# Altium project PCB_Project1.PrjPCB
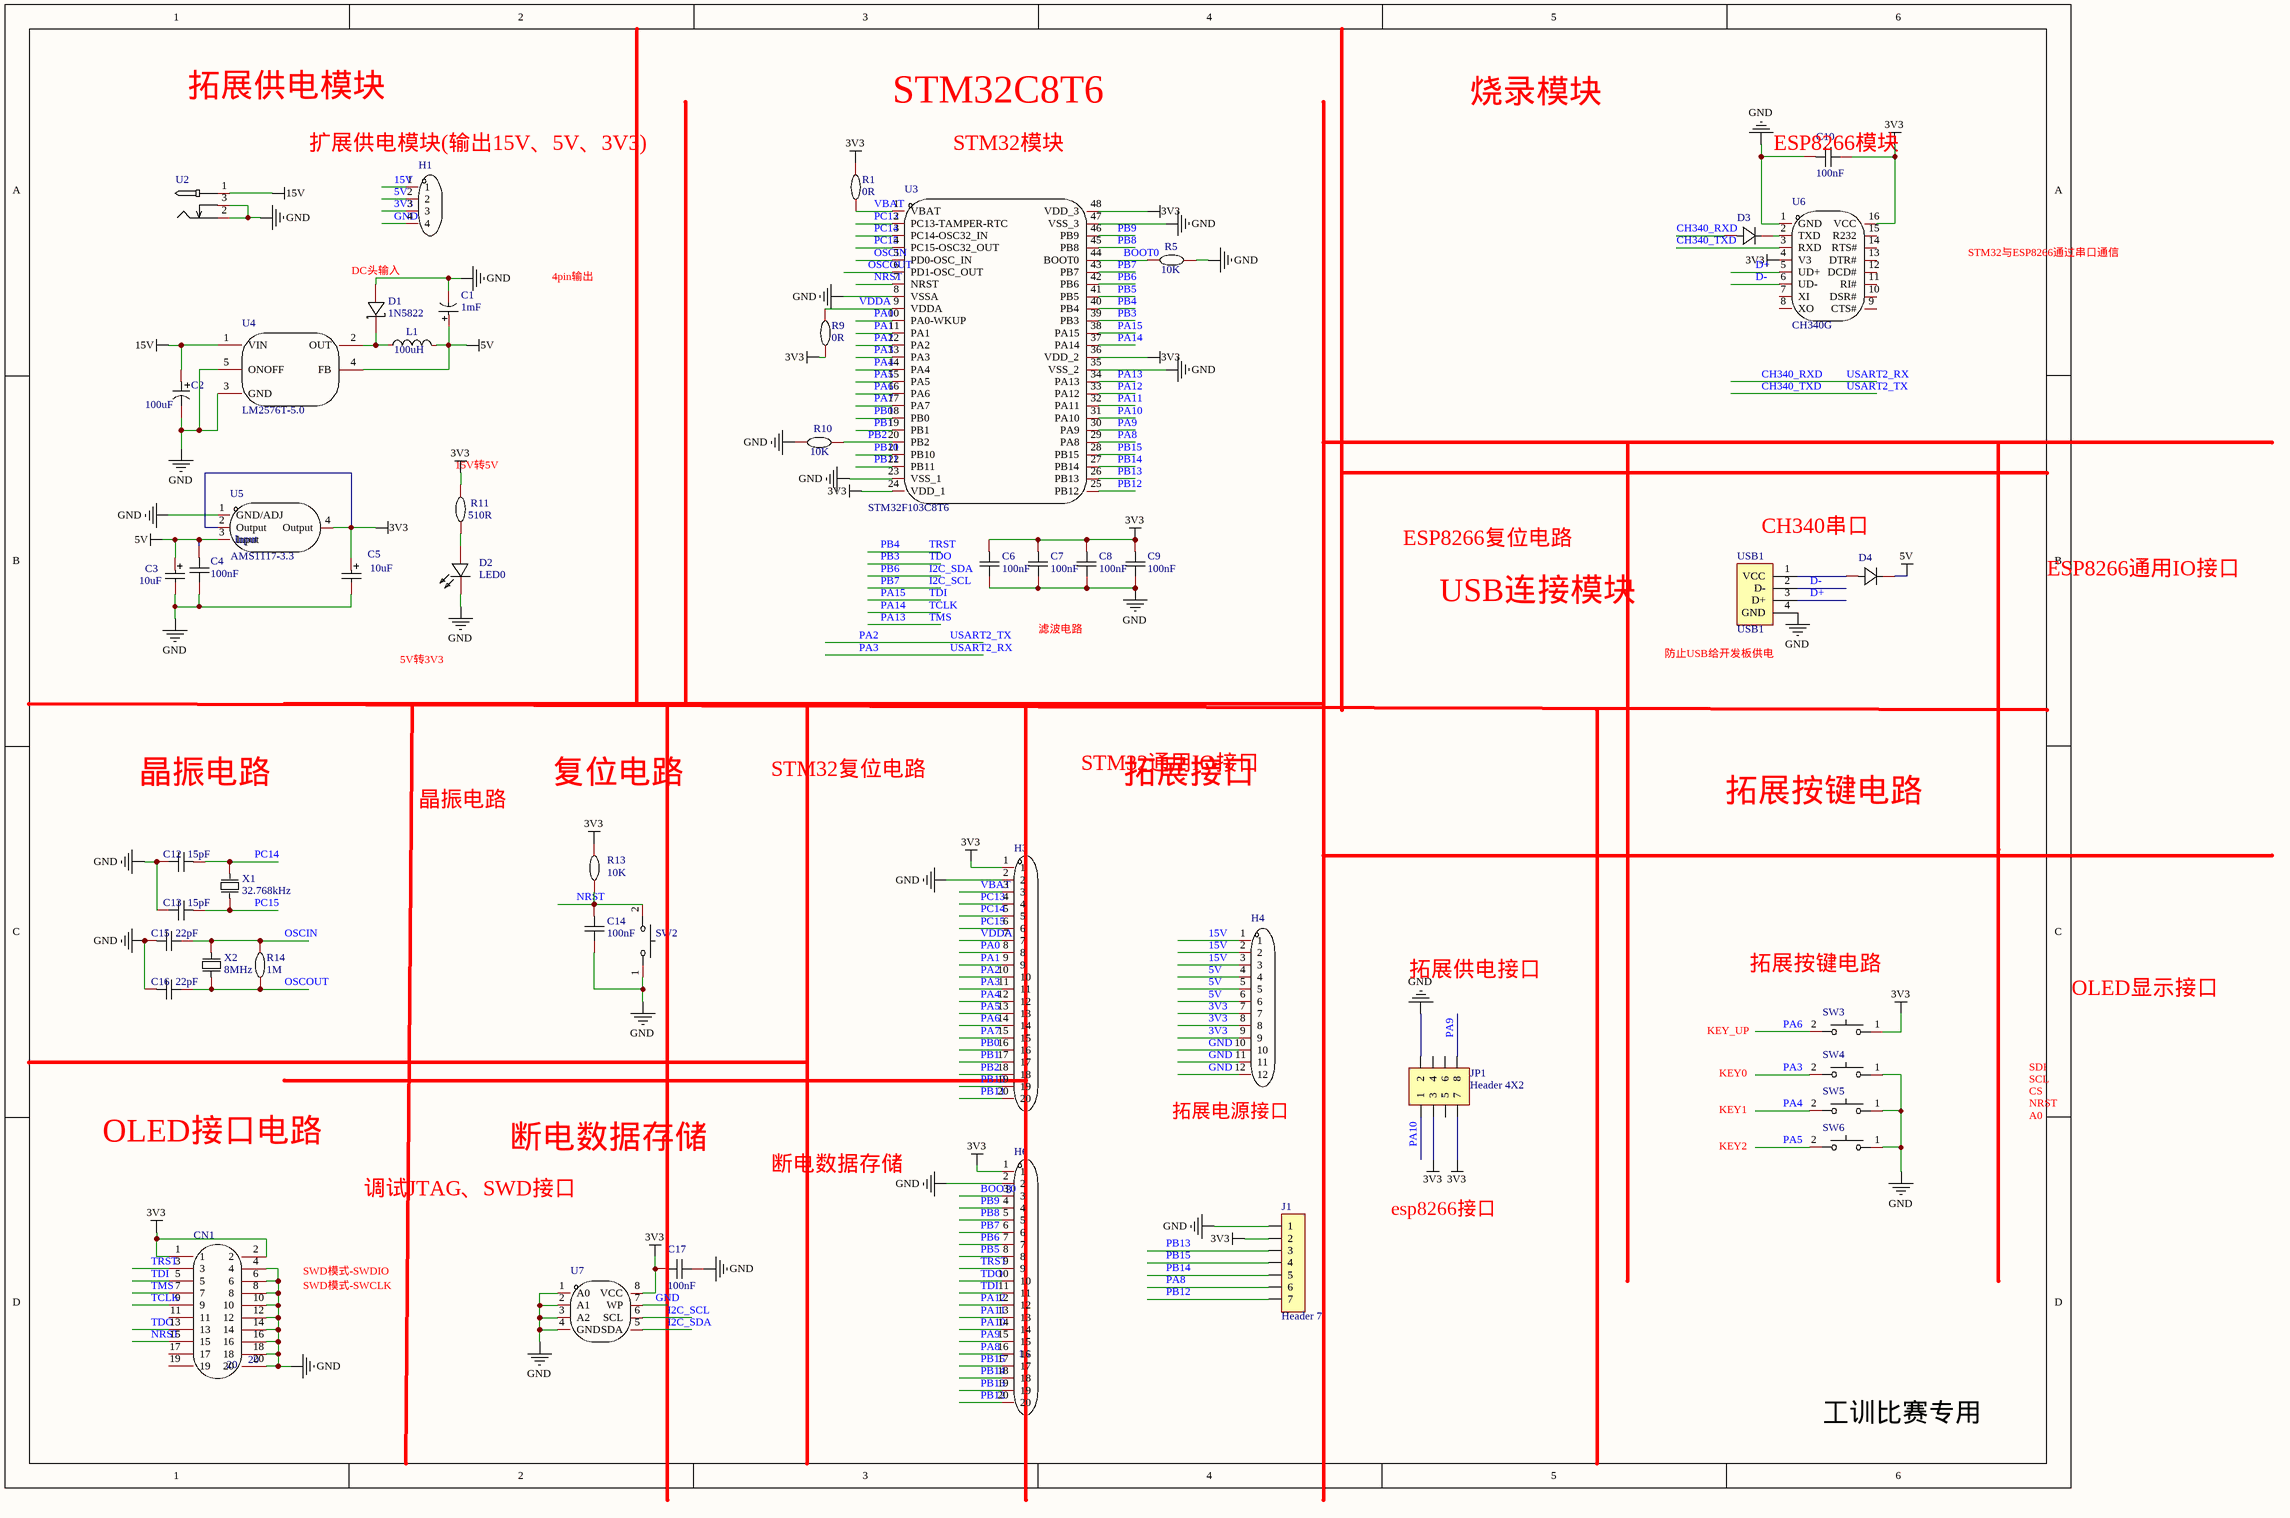
[diagram p0: Sheet1.SchDoc]
1 sheet, 49 parts. Net scope: global (net labels, ports and power ports of the same name join across sheets).
Board file: PCB1.PcbDoc

## Sheet Sheet1.SchDoc
size 431 x 309 mm

### Parts
C1  value 1mF  [CM D8(6.3*7.7)]  (hidden comment: NXA25VB1000M 10*20 LO)
C2  value 100uF  [CM F(8*10.2)]  (hidden comment: XT100UF50V90RV0067)
C3  value 10uF  [CASE-A_3216]  (hidden comment: CA45-A-10V-10uF-K)
C4  value 100nF  [0603_C]  (hidden comment: CAP_0603)
C5  value 10uF  [CASE-A_3216]  (hidden comment: CA45-A-10V-10uF-K)
C6  value 100nF  [0603_C]  (hidden comment: CAP_0603)
C7  value 100nF  [0603_C]  (hidden comment: CAP_0603)
C8  value 100nF  [0603_C]  (hidden comment: CAP_0603)
C9  value 100nF  [0603_C]  (hidden comment: CAP_0603)
C10  value 100nF  [0603_C]  (hidden comment: CAP_0603)
C12  value 15pF  [0603_C]  (hidden comment: CAP_0603)
C13  value 15pF  [0603_C]  (hidden comment: CAP_0603)
C14  value 100nF  [0603_C]  (hidden comment: CAP_0603)
C15  value 22pF  [0603_C]  (hidden comment: CAP_0603)
C16  value 22pF  [0603_C]  (hidden comment: CAP_0603)
C17  value 100nF  [0603_C]  (hidden comment: CAP_0603)
CN1  NAME: 20  [DC-2.54-L-Z-20P]  (hidden comment: HX30002-20A)
D1  1N5822  [SMA(DO-214AC)]
D2  Name: LED0  [LED 0603R]  (hidden comment: 25-21/GHC-YSU/2A)
D3  1N4007  [SOD-323]  (value not drawn)
D4  1N4007  [SOD-323]  (value not drawn)
H1  HDR-M_2.54_1x4P  [HDR2.54-LI-4P]  (value not drawn)
H3  HDR-M_2.54_1x20P  [HDR2.54-LI-20P]  (value not drawn)
H4  HDR-M_2.54_1x12P  [HDR2.54-LI-12P]  (value not drawn)
H6  NAME: 16  NUMBER: 3  [HDR2.54-LI-20P]  (hidden comment: HDR-M_2.54_1x20P)
J1  Header 7  [HDR2.54-LI-7P]
JP1  Header 4X2  [HDR2.54-LI-2x4P]
L1  value 100uH  [CDRH127]  (hidden comment: CY75-100UH)
R1  value 0R  [0603_R]  (hidden comment: RK73Z2BTTD)
R5  value 10K  [0603_R]  (hidden comment: Res_0603)
R9  value 0R  [0603_R]  (hidden comment: Res_0603)
R10  value 10K  [0603_R]  (hidden comment: Res_0603)
R11  value 510R  [0603_R]  (hidden comment: Res_0603)
R13  value 10K  [0603_R]  (hidden comment: Res_0603)
R14  value 1M  [0603_R]  (hidden comment: Res_0603)
SW2  SW-74-3  [TSW SMD-3*6*2.5]  (value not drawn)
SW3  SW-74-3  [TSW SMD-3*6*2.5]  (value not drawn)
SW4  SW-74-3  [TSW SMD-3*6*2.5]  (value not drawn)
SW5  SW-74-3  [TSW SMD-3*6*2.5]  (value not drawn)
SW6  SW-74-3  [TSW SMD-3*6*2.5]  (value not drawn)
U2  DC-210_DC母座,板上插件3P,2mm,黑壳  [DC-005]  (value not drawn)
U3  STM32F103C8T6  [LQFP48 7X7_N]
U4  Name: LM2576T-5.0  [TO-263-5]  (hidden comment: LM2576T-5.0/NOPB)
U5  Name: AMS1117-3.3  NAME: Input  [SOT-223]  (hidden comment: AMS1117-3.3_C369933)
U6  CH340G  [SOP-16_150mil]
U7  AT24C04M/TR  [SOP-8_150mil]  (value not drawn)
USB1  USB1  [USB-A/S_A]
X1  value 32.768kHz  [OSC 3215-2P]  (hidden comment: ABS06-32.768KHZ-T)
X2  value 8MHz  [HC-49SMD]  (hidden comment: X49SS2-8.000-F20JGDT)

### Nets
3V3: C5.1 C6.2 C7.2 C8.2 C9.2 C10.1 C17.2 CN1.1 CN1.2 H1.3 H3.1 H4.7 H4.8 H4.9 H6.1 J1.2 JP1.3 JP1.7 R1.2 R9.1 R11.2 R13.2 SW3.1 U3.24(VDD_1) U3.36(VDD_2) U3.48(VDD_3) U5.2(Output) U5.4(Output) U6.4(V3) U6.16(VCC) U7.8(VCC)
5V: C1.1 C3.1 C4.2 D4.2(K) H1.2 H4.4 H4.5 H4.6 L1.2 U4.4(FB) U5.3(Input)
15V: C2.1 H1.1 H4.1 H4.2 H4.3 U2.1 U4.1(VIN)
GND: C1.2 C2.2 C3.2 C4.1 C5.2 C6.1 C7.1 C8.1 C9.1 C10.2 C12.1 C13.1 C14.1 C15.2 C16.2 C17.1 CN1.4 CN1.6 CN1.8 CN1.10 CN1.12 CN1.14 CN1.16 CN1.18 CN1.20 D1.2(A) D2.2(K) H1.4 H3.2 H4.10 H4.11 H4.12 H6.2 J1.1 JP1.2 R5.2 R10.1 SW2.1 SW4.1 SW5.1 SW6.1 U2.2 U2.3 U3.8(VSSA) U3.23(VSS_1) U3.35(VSS_2) U3.47(VSS_3) U4.3(GND) U4.5(ONOFF) U5.1(GND/ADJ) U6.1(GND) U7.1(A0) U7.2(A1) U7.3(A2) U7.4(GND) U7.7(WP) USB1.4(GND)
BOOT0: H6.3 R5.1 U3.44(BOOT0)
CH340_RXD: D3.1(A) H3.11 SW4.2 U3.13(PA3)  [also labelled PA3, USART2_RX]
CH340_TXD: H3.10 U3.12(PA2) U6.3(RXD)  [also labelled PA2, USART2_TX]
D+: U6.5(UD+) USB1.3(D+)
D-: U6.6(UD-) USB1.2(D-)
I2C_SCL: H6.6 U3.43(PB7) U7.6(SCL)  [also labelled PB7]
I2C_SDA: H6.7 U3.42(PB6) U7.5(SDA)  [also labelled PB6]
NRST: C14.2 CN1.15 R13.1 SW2.2 U3.7(NRST)
OSCIN: C15.1 R14.2 U3.5(PD0-OSC_IN) X2.2(OSC2)
OSCOUT: C16.1 R14.1 U3.6(PD1-OSC_OUT) X2.1(OSC1)
PA0: H3.8 U3.10(PA0-WKUP)
PA1: H3.9 U3.11(PA1)
PA4: H3.12 SW5.2 U3.14(PA4)
PA5: H3.13 SW6.2 U3.15(PA5)
PA6: H3.14 SW3.2 U3.16(PA6)
PA7: H3.15 U3.17(PA7)
PA8: H6.16 J1.6 U3.29(PA8)
PA9: H6.15 JP1.8 U3.30(PA9)
PA10: H6.14 JP1.1 U3.31(PA10)
PA11: H6.13 U3.32(PA11)
PA12: H6.12 U3.33(PA12)
PA13: CN1.7 U3.34(PA13)  [also labelled TMS]
PA14: CN1.9 U3.37(PA14)  [also labelled TCLK]
PA15: CN1.5 H6.11 U3.38(PA15)  [also labelled TDI]
PB0: H3.16 U3.18(PB0)
PB1: H3.17 U3.19(PB1)
PB2: H3.18 R10.2 U3.20(PB2)
PB3: CN1.13 H6.10 U3.39(PB3)  [also labelled TDO]
PB4: CN1.3 H6.9 U3.40(PB4)  [also labelled TRST]
PB5: H6.8 U3.41(PB5)
PB8: H6.5 U3.45(PB8)
PB9: H6.4 U3.46(PB9)
PB10: H3.19 U3.21(PB10)
PB11: H3.20 U3.22(PB11)
PB12: H6.20 J1.7 U3.25(PB12)
PB13: H6.19 J1.3 U3.26(PB13)
PB14: H6.18 J1.5 U3.27(PB14)
PB15: H6.17 J1.4 U3.28(PB15)
PC13: H3.4 U3.2(PC13-TAMPER-RTC)
PC14: C12.2 H3.5 U3.3(PC14-OSC32_IN) X1.2(OSC2)
PC15: C13.2 H3.6 U3.4(PC15-OSC32_OUT) X1.1(OSC1)
VBAT: H3.3 R1.1 U3.1(VBAT)
VDDA: H3.7 R9.2 U3.9(VDDA)
NetD1_1: D1.1(C) L1.1 U4.2(OUT)
NetD2_1: D2.1(A) R11.1
NetD3_2: D3.2(K) U6.2(TXD)
NetD4_1: D4.1(A) USB1.1(VCC)

Not connected (* = marked no-connect by the designer): CN1 11 17 19; JP1 4 5 6; U6 7(XI) 8(XO) 9(CTS#) 10(DSR#) 11(RI#) 12(DCD#) 13(DTR#) 14(RTS#) 15(R232)

### Notes on the sheet
- 拓展供电模块
- STM32C8T6
- 烧录模块
- USB连接模块
- 晶振电路
- 复位电路
- 拓展接口
- 拓展按键电路
- (near JP1) 拓展电源接口
- OLED接口电路
- 断电数据存储
- esp8266接口
- 工训比赛专用
- (in symbol SW-74-3) 扩展供电模块(输出15V、5V、3V3); STM32模块; ESP8266模块; STM32与ESP8266通过串口通信; DC头输入; 4pin输出; 15V转5V; CH340串口; ESP8266复位电路; ESP8266通用IO接口; 滤波电路; 防止USB给开发板供电; 5V转3V3; STM32通用IO接口; STM32复位电路; 晶振电路; 拓展按键电路; 拓展供电接口; OLED显示接口; KEY_UP; SDI; KEY0; SCL; CS; NRST; KEY1; A0; KEY2; 断电数据存储; 调试JTAG、SWD接口; SWD模式-SWDIO; SWD模式-SWCLK

### Library data of the parts
C1 = NXA25VB1000M 10*20 LO: 容值:1mF;精度:±20%;额定电压:25V;电容体直径:10mm;电容体长度:20mm;脚间距:5mm;工作寿命:7000hrs@105;; Manufacturer: SAMYOUNG(韩国三莹); Symbol: NXA25V1000UF10*20; Add into BOM: yes; Tolerance: ±20%; Rated Voltage: 25V; φD: 10mm; L: 20mm; Name: 1mF; Device: NXA25VB1000M 10*20 LO; LCSC Part Name: 1mF ±20% 25V; Supplier Part: C150381; Manufacturer Part: NXA25VB1000M 10*20 LO; Supplier Footprint: 径向引线,10x20mm; JLCPCB Part Class: 扩展库; Datasheet: https://atta.szlcsc.com/upload/public/pdf/source/20180207/C150381_15179948733761359072.pdf; Supplier: LCSC; Convert to PCB: yes; Lead Spacing: 5mm; Lifetime @ Temp: 7000hrs@105
C2 = XT100UF50V90RV0067: 容值:100uF;额定电压:50V;电容体直径:-;电容体长度:-;纹波电流:-;等效串联电阻:-;工作寿命:-;; Manufacturer: KNSCHA(科尼盛); Add into BOM: yes; Rated Voltage: 50V; Name: 100uF; Symbol: XT100UF50V90RV0067; Device: XT100UF50V90RV0067; LCSC Part Name: 100uF 50V; Supplier Part: C2992599; Manufacturer Part: XT100UF50V90RV0067; Supplier Footprint: SMD,8x10.5mm; JLCPCB Part Class: 扩展库; Datasheet: https://atta.szlcsc.com/upload/public/pdf/source/20220628/DB8CB200A5425945B2B1ADF515822AD1.pdf; Supplier: LCSC; Convert to PCB: yes; φD: -; L: -; Ripple Current: -; Equivalent Series Resistance(ESR): -; Lifetime @ Temp: -
C3 C5 = CA45-A-10V-10uF-K: 额定电压:10V;等效串联电阻:8Ω 100kHz;工作温度:-55~+125;容值:10uF;精度:±10%;; Manufacturer: CEC(振华新云); Add into BOM: yes; Rated Voltage: 10V; Tolerance: ±10%; Name: 10uF; Symbol: CA45-A-10V-10UF-K; Device: CA45-A-10V-10uF-K; LCSC Part Name: 10uF(106) ±10% 10V; Supplier Part: C128253; Manufacturer Part: CA45-A-10V-10uF-K; Supplier Footprint: CASE-A_3216; JLCPCB Part Class: 扩展库; Datasheet: https://atta.szlcsc.com/upload/public/pdf/source/20170914/C128253_1505359751786967904.pdf; Supplier: LCSC; Convert to PCB: yes; Equivalent Series Resistance(ESR): 8Ω 100kHz; Operating Temperature: -55~+125
C4 C6-C10 C12-C17 = CAP_0603: Symbol: C1210X7R475K630NT; Convert to PCB: yes; Device: CAP_0603; Add into BOM: yes; Supplier Footprint: 0603
  C4 C6-C10 C14 C17: Name: 100nF
  C12 C13: Name: 15pF
  C15 C16: Name: 22pF
CN1 = HX30002-20A: 参考系列:-;间距:3mm;插针结构:2x10P;排数:2;每排PIN数:10;行距:3mm;安装方式:-;触头材质:黄铜;; Manufacturer: HX(红星); Symbol: 30002-20A-T1P; Add into BOM: yes; Pitch: 3mm; Pins Structure: 2x10P; Number of PINs Per Row: 10; Name: HX30002-20A; Device: HX30002-20A; LCSC Part Name: 小5569-20A; Supplier Part: C185097; Manufacturer Part: HX30002-20A; Supplier Footprint: 插件,P=3mm; JLCPCB Part Class: 扩展库; Datasheet: https://atta.szlcsc.com/upload/public/pdf/source/20180316/2650DEF6C4F462ECBA0CD08C5E43C847.pdf; Supplier: LCSC; Convert to PCB: yes; Reference Series: -; Number of Rows: 2; Row Spacing: 3mm; Mounting Style: -; Contact Material: 黄铜; NO_CONNECT: yes; NUMBER: 20
D1 = 1N5822: 直流反向耐压(Vr):40V;平均整流电流(Io):3A;正向压降(Vf):525mV@3A;; Manufacturer: 星海; Symbol: 1N5822_C84619; Add into BOM: yes; Reverse Voltage (Vr): 40V; Average Rectified Current (Io): 3A; Name: 1N5822; Device: 1N5822; LCSC Part Name: 40V 3A 525mV@3A; Supplier Part: C84619; Manufacturer Part: 1N5822; Supplier Footprint: DO-201AD; JLCPCB Part Class: 扩展库; Datasheet: https://atta.szlcsc.com/upload/public/pdf/source/20161024/1477288663229.pdf; Supplier: LCSC; Convert to PCB: yes; Forward Voltage (Vf@If): 525mV@3A
D2 = 25-21/GHC-YSU/2A: Manufacturer: EVERLIGHT(亿光); Add into BOM: yes; Symbol: 25-21/GHC-YSU/2A; Device: 25-21/GHC-YSU/2A; LCSC Part Name: LED; Supplier Part: C4749157; Manufacturer Part: 25-21/GHC-YSU/2A; Supplier Footprint: SMD-2,1.6x3.2mm; JLCPCB Part Class: 扩展库; Datasheet: https://atta.szlcsc.com/upload/public/pdf/source/20220713/F252FF7039D6458B569E79FE2BD3F03F.pdf; Supplier: LCSC; Convert to PCB: yes
D3 D4 = 1N4007: 二极管配置:-;直流反向耐压(Vr):1kV;平均整流电流(Io):1A;正向压降(Vf):1.1V@1A;反向电流(Ir):5A@1kV;; Symbol: D_1N4007; Add into BOM: yes; Device: 1N4007; Supplier Footprint: DO-41; Convert to PCB: yes; Supplier Part: C106903; JLCPCB Part Class: Extended Part
H1 = HDR-M_2.54_1x4P: Symbol: PZ254V-11-04P; Convert to PCB: yes; Device: HDR-M_2.54_1x4P; Add into BOM: yes; Supplier Part: C492403; Supplier Footprint: 插件
H3 H6 = HDR-M_2.54_1x20P: 间距:2.54mm;总PIN位数:20;排数:1;插针结构:-;行距:-;安装类型:直插;圆针/方针:-;额定电流:-;额定电压:-;配合针长度:-;塑高:-;触头材质:黄铜;触头镀层:-;颜色:黑色;; Symbol: HDR_2.54-1x20P; Convert to PCB: yes; Device: HDR-M_2.54_1x20P; Add into BOM: yes; Supplier Part: C50981; Supplier Footprint: 插件
H4 = HDR-M_2.54_1x12P: 间距:2.54mm;总PIN位数:12;排数:1;插针结构:1x12P;行距:-;安装类型:直插;圆针/方针:方针;额定电流:3A;额定电压:250V;配合针长度:6mm;塑高:2.5mm;端接针长度:3mm;触头材质:-;工作温度范围:-40~+105;颜色:黑色;; Symbol: HDR_2.54-1x12P; Convert to PCB: yes; Device: HDR-M_2.54_1x12P; Add into BOM: yes; Supplier Part: C2840012; Supplier Footprint: 插件
J1 = Header 7: J  Header, 7-Pin; LatestRevisionDate: 17-Jul-2002; LatestRevisionNote: Re-released for DXP Platform.; Publisher: Altium Limited
JP1 = Header 4X2: J  Header, 4-Pin, Dual row; LatestRevisionDate: 17-Jul-2002; LatestRevisionNote: Re-released for DXP Platform.; Publisher: Altium Limited
L1 = CY75-100UH: 电感值:100uH;精度:±10%;额定电流:730mA;饱和电流(Isat):-;直流电阻(DCR):325mΩ;; Manufacturer: SHOU HAN(首韩); Add into BOM: yes; Tolerance: ±10%; Rated Current: 730mA; DC Resistance (DCR): 325mΩ; Name: 100uH; Symbol: CY75-100UH; Device: CY75-100UH; LCSC Part Name: 100uH ±10% 730mA 325mΩ; Supplier Part: C2929443; Manufacturer Part: CY75-100UH; Supplier Footprint: SMD,7.8x7x5mm; JLCPCB Part Class: 扩展库; Datasheet: https://atta.szlcsc.com/upload/public/pdf/source/20211213/9462A2F321BE8943DF3982CE0F9F6E2B.pdf; Supplier: LCSC; Convert to PCB: yes; Saturation Current (Isat): -; Q @ Freq: -; Frequency - Self Resonant: -; Ratings: -
R1 = RK73Z2BTTD: 阻值:0Ω;精度:-;功率:-;工作温度范围:-55~+155;; Manufacturer: KOA; Add into BOM: yes; Name: 0R; Symbol: RK73Z2BTTD; Device: RK73Z2BTTD; LCSC Part Name: 0Ω 0; Supplier Part: C131706; Manufacturer Part: RK73Z2BTTD; Supplier Footprint: 1206; JLCPCB Part Class: 扩展库; Datasheet: https://atta.szlcsc.com/upload/public/pdf/source/20170918/C131706_1505727048923976489.pdf; Supplier: LCSC; Convert to PCB: yes; Tolerance: -; Power(Watts): -; Operating Temperature Range: -55~+155
R5 R9-R11 R13 R14 = Res_0603: Symbol: 电阻; Convert to PCB: yes; Device: Res_0603; Add into BOM: yes; Supplier Footprint: 0603
  R5 R10 R13: Name: 10K
  R9: Name: 0R
  R11: Name: 510R
  R14: Name: 1M
SW2-SW6 = SW-74-3: 类型:检测开关;额定电流(DC):1mA;额定电压(DC):5V;额定电流(AC):1mA;额定电压(AC):100V;机械寿命:20000;按钮形状:圆形柱塞;引脚样式:PC引脚;开关长度:7mm;开关宽度:4.4mm;开关高度:7.2mm;; Manufacturer: Shinmei(日本神明); Add into BOM: yes; Contact Current (DC): 1mA; Voltage Rating (DC): 5V; Voltage Rating (AC): 100V; Mechanical Life: 20000; Actuator Style: 圆形柱塞; Pin Style: PC引脚; Switch Length: 7mm; Switch Width: 4.4mm; Switch Height: 7.2mm; Name: SW-74-3; Symbol: SW-74-3; Device: SW-74-3; LCSC Part Name: SW-74-3; Supplier Part: C388893; Manufacturer Part: SW-74-3; Supplier Footprint: 插件; JLCPCB Part Class: 扩展库; Datasheet: https://atta.szlcsc.com/upload/public/pdf/source/20190506/C388893_3452A3DB9C6C6AE4480AE332CD6BDAAB.pdf; Supplier: LCSC; Convert to PCB: yes; Type: 检测开关; Contact Current (AC): 1mA
U2 = DC-210_DC母座,板上插件3P,2mm,黑壳: Add into BOM: yes; Name: DC-210_DC母座,板上插件3P,2mm,黑壳; Symbol: DC-210_DC母座,板上插件3P,2MM,黑壳; Device: DC-210_DC母座,板上插件3P,2mm,黑壳; LCSC Part Name: DC-210_DC母座,板上插件3P,2mm,黑壳; Supplier Part: C9900012165; Manufacturer Part: DC-210_DC母座,板上插件3P,2mm,黑壳; Supplier Footprint: DC-210_2.0mm; JLCPCB Part Class: 扩展库; Datasheet: https://atta.szlcsc.comnull; Supplier: LCSC; Convert to PCB: yes
U3 = STM32F103C8T6: CPU内核:ARM Cortex-M3;CPU最大主频:72MHz;工作电压范围:2V~3.6V;内部振荡器:有;程序 FLASH容量:64K@x8bit;RAM总容量:20KB;EEPROM/数据 FLASH容量:-;GPIO端口数量:37;ADC(单元数/通道数/位数):1@x10ch/12bit;外设/功能/协议栈:温度传感器；DMA；看门狗；POR；PWM;工作温度范围:-40~+85;; Manufacturer: ST(意法半导体); Add into BOM: yes; Maximum Frequency: 72MHz; Internal Oscillator: 有; RAM Size: 20KB; GPIO Ports Number: 37; Name: STM32F103C8T6; Symbol: STM32F103C8T6; Device: STM32F103C8T6; LCSC Part Name: ARM Cortex-M3 72MHz 64K@x8bit 20KB MSL=3; Supplier Part: C8734; Manufacturer Part: STM32F103C8T6; Supplier Footprint: LQFP-48_7x7x05P; JLCPCB Part Class: 基础库; Datasheet: https://atta.szlcsc.com/upload/public/pdf/source/20140724/1457707174202.pdf; Supplier: LCSC; Convert to PCB: yes; CPU Core: ARM Cortex-M3; Supply Voltage Range: 2V~3.6V; Program FLASH Size: 64K@x8bit; EEPROM/Data FLASH Size: -; ADC (Units/Channels/bits): 1@x10ch/12bit; Peripherals / Functions / Protocol Stacks: 温度传感器；DMA；看门狗；POR；PWM; Operating Temperature Range: -40~+85
U4 = LM2576T-5.0/NOPB: 功能类型:降压型;同步整流:-;输出通道数:-;拓扑结构:-;输入电压:-;输出电流(最大值):-;开关频率:-;; Manufacturer: TI(德州仪器); Symbol: LM2576T-5.0_C16254; Add into BOM: yes; Function: 降压型; Device: LM2576T-5.0/NOPB; LCSC Part Name: 降压型; Supplier Part: C16254; Manufacturer Part: LM2576T-5.0/NOPB; Supplier Footprint: TO-220-5; Datasheet: https://atta.szlcsc.com/upload/public/pdf/source/20130814/1457706636795.pdf; Supplier: LCSC; Convert to PCB: yes; Synchronous Rectification: -; Number of Outputs: -; Topology: -; Input Voltage: -; Output Current (Max): -; Switching Frequency: -
U5 = AMS1117-3.3_C369933: 输出类型:固定;输出极性:正;输出通道数:1;最大输入电压:18V;输出电压:3.3V;压差:1.3V@800mA;静态电流(地电流):8mA;输出电流:1A;电源纹波抑制比(PSRR):-;噪声:-;特性:-;工作温度:-;; Manufacturer: KEXIN(科信); Add into BOM: yes; Output Type: 固定; Output Polarity: 正; Number of Outputs: 1; Maximum Input Voltage: 18V; Output Voltage: 3.3V; Quiescent Current (Ground Current): 8mA; Output Current: 1A; Symbol: AMS1117-3.3_C369933; Device: AMS1117-3.3_C369933; LCSC Part Name: Vin=18V Vout=3.3V 1A; Supplier Part: C369933; Manufacturer Part: AMS1117-3.3; Supplier Footprint: SOT-223; JLCPCB Part Class: 扩展库; Datasheet: https://atta.szlcsc.com/upload/public/pdf/source/20190724/C369933_94137CB0CFA8D6ABD8E5DA714A2C2C4B.pdf; Supplier: LCSC; Convert to PCB: yes; Dropout Voltage: 1.3V@800mA; Power Supply Rejection Ratio (PSRR): -; Noise: -; Feature: -; Operating Temperature: -; NO_CONNECT: yes
U6 = CH340G: 类型:Transceiver;协议类别:USB 2.0;驱动器/接收器数:-;数据速率:2Mbps;; Manufacturer: WCH(南京沁恒); Add into BOM: yes; Protocol: USB 2.0; Data Rate: 2Mbps; Supply Voltage: 3.3V, 5V; Name: CH340G; Symbol: CH340G; Device: CH340G; LCSC Part Name: CH340G; Supplier Part: C14267; Manufacturer Part: CH340G; Supplier Footprint: SOP-16_150mil; JLCPCB Part Class: 扩展库; Datasheet: https://atta.szlcsc.com/upload/public/pdf/source/20200819/C14267_9F0B4B8160AEBA86F3219E64956E4601.pdf; Supplier: LCSC; Convert to PCB: yes; Type: Transceiver; Number of Drivers/Receivers: -; NO_CONNECT: yes
U7 = AT24C04M/TR: 存储器类型:-;存储器容量:-;存储器接口类型:-;工作电压:-;; Manufacturer: HGSEMI(华冠); Add into BOM: yes; Name: AT24C04M/TR; Symbol: AT24C04M/TR; Device: AT24C04M/TR; LCSC Part Name: EEPROM存储器; Supplier Part: C2688456; Manufacturer Part: AT24C04M/TR; Supplier Footprint: SOP-8; JLCPCB Part Class: 扩展库; Datasheet: https://atta.szlcsc.com/upload/public/pdf/source/20210719/C565361_F396BA4F8936B5234E7942D8C3C128A6.pdf; Supplier: LCSC; Convert to PCB: yes; Memory Type: -; Memory Format: -; Memory Size: -; Memory Interface: -; Voltage - Supply: -
USB1 = USB1: J  USB接口
X1 = ABS06-32.768KHZ-T: 晶振类型:-;频率:32.768kHz;频率公差:±20ppm;频率稳定度:-;负载电容:12.5pF;等效串联电阻(ESR):90kΩ;工作温度:-40~+85;; Manufacturer: ABRACON; Add into BOM: yes; Frequency Tolerance: ±20ppm; Load Capacitance: 12.5pF; Equivalent Series Resistance (ESR): 90kΩ; Name: 32.768kHz; Symbol: ABS06-32.768KHZ-T; Device: ABS06-32.768KHZ-T; LCSC Part Name: 32.768kHz ±20ppm 12.5pF; Supplier Part: C276423; Manufacturer Part: ABS06-32.768KHZ-T; Supplier Footprint: SMD2012-2P; JLCPCB Part Class: 扩展库; Datasheet: https://atta.szlcsc.com/upload/public/pdf/source/20180906/C276423_617CC087DECB982B4D7E659BEEA3B1E4.pdf; Supplier: LCSC; Convert to PCB: yes; Crystal Type: -; Frequency Stability: -; Operating Temperature: -40~+85
X2 = X49SS2-8.000-F20JGDT: 晶振类型:49SMD;频率:8MHz;频率公差:±30ppm;频率稳定度:±50ppm;负载电容:20pF;等效串联电阻(ESR):-;工作温度:-40~+85;; Manufacturer: HCI(杭晶); Add into BOM: yes; Crystal Type: 49SMD; Frequency Tolerance: ±30ppm; Frequency Stability: ±50ppm; Load Capacitance: 20pF; Name: 8MHz; Symbol: X49SS2-8.000-F20JGDT; Device: X49SS2-8.000-F20JGDT; LCSC Part Name: 8MHz ±30ppm 20pF; Supplier Part: C2842263; Manufacturer Part: X49SS2-8.000-F20JGDT; Supplier Footprint: HC-49SMD; Datasheet: https://atta.szlcsc.com/upload/public/pdf/source/20220525/41AB7615A6CBF59B0A628FE584B63957.pdf; Supplier: LCSC; Convert to PCB: yes; Equivalent Series Resistance (ESR): -; Operating Temperature: -40~+85